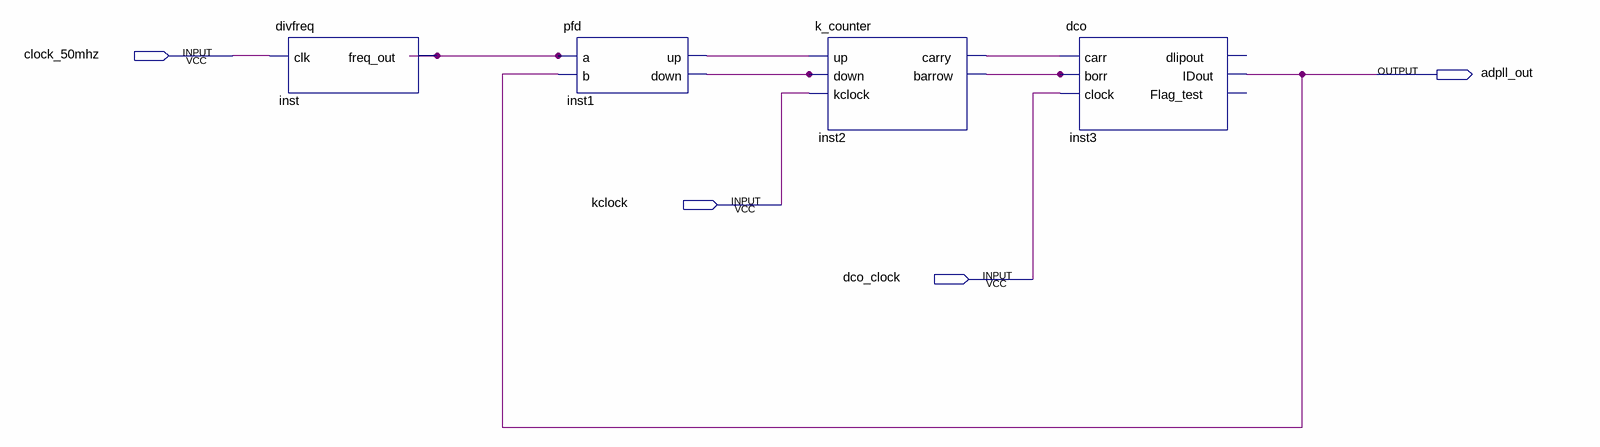
[diagram p0: schematic sheet]
// Quartus schematic pll.bdf as structural Verilog: 4 symbols, 4 pins
module pll (
  input  clock_50mhz,
  input  kclock,
  input  dco_clock,
  output adpll_out
);

  wire inst1_down, inst1_up, inst2_barrow, inst2_carry, inst_freq_out;

  divfreq inst (.clk(clock_50mhz), .freq_out(inst_freq_out));
  pfd inst1 (.a(inst_freq_out), .b(adpll_out), .up(inst1_up), .down(inst1_down));
  k_counter inst2 (.up(inst1_up), .down(inst1_down), .kclock(kclock), .carry(inst2_carry), .barrow(inst2_barrow));
  dco inst3 (
    .carr(inst2_carry), .borr(inst2_barrow), .clock(dco_clock), .IDout(adpll_out));  // open: dlipout, Flag_test
endmodule
